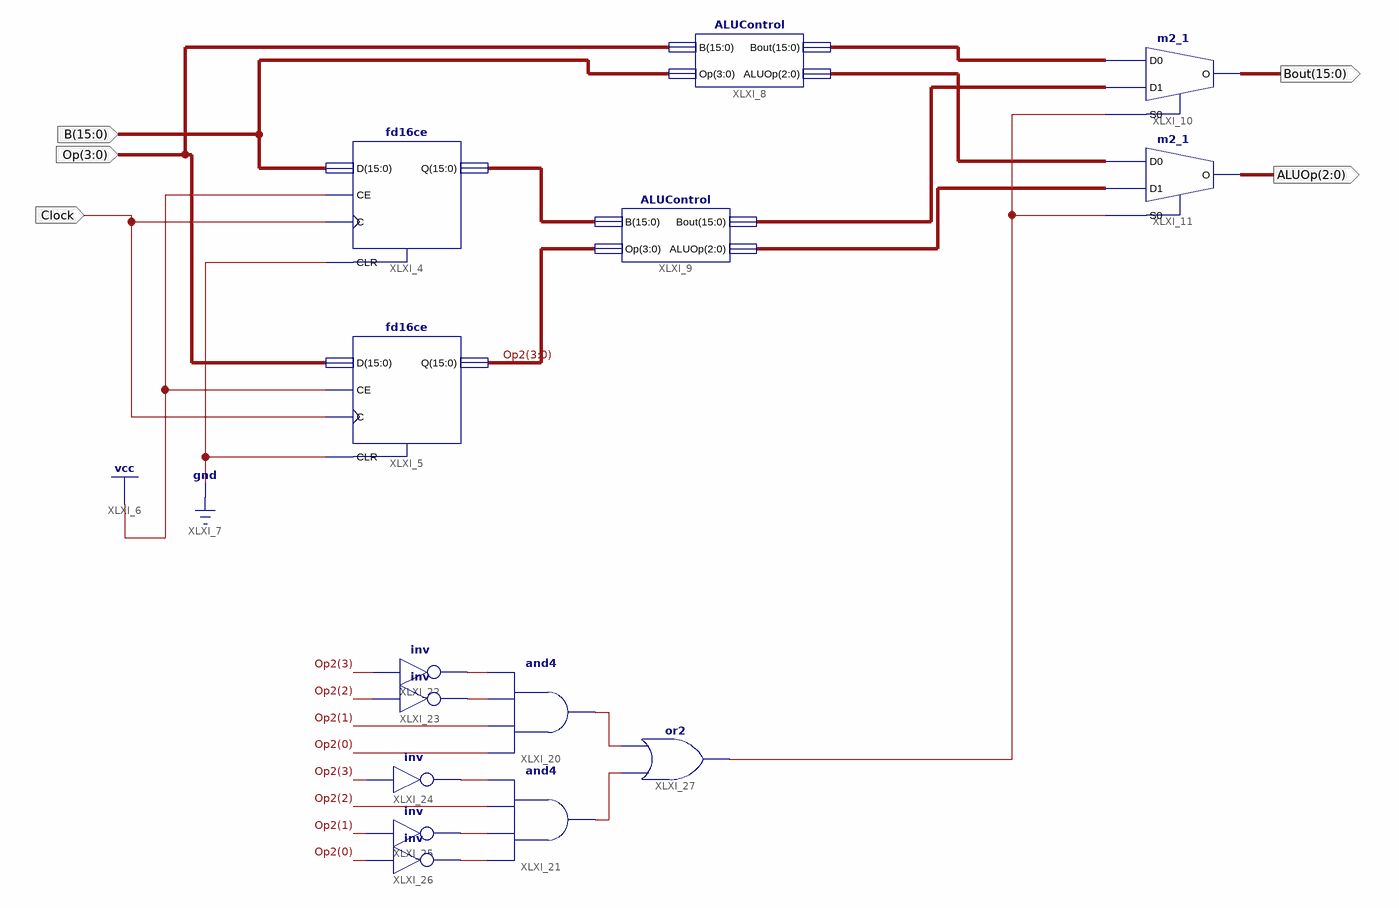
[diagram p0: schematic sheet 1]
// Xilinx ISE schematic MulticycleALU.sch (spartan3e) as structural Verilog: 14 symbols, 5 ports
module MulticycleALU (
  input  [15:0] B,
  input  [3:0] Op,
  input  Clock,
  output [15:0] Bout,
  output [2:0] ALUOp
);

  wire XLXN_39, XLXN_40, XLXN_41, XLXN_42, XLXN_43, XLXN_44, XLXN_54, XLXN_55;
  wire [2:0] XLXN_15, XLXN_20;
  wire [3:0] Op2;
  wire [15:0] XLXN_14, XLXN_16, XLXN_19;

  fd16ce XLXI_4 (.C(Clock), .CE(1'b1), .CLR(1'b0), .D(B), .Q(XLXN_16));
  fd16ce XLXI_5 (.C(Clock), .CE(1'b1), .CLR(1'b0), .D(Op), .Q(Op2));
  ALUControl XLXI_8 (.B(Op), .Op(B), .Bout(XLXN_14), .ALUOp(XLXN_15));
  ALUControl XLXI_9 (.B(XLXN_16), .Op(Op2), .Bout(XLXN_19), .ALUOp(XLXN_20));
  m2_1 XLXI_10 (.D0(XLXN_14), .D1(XLXN_19), .S0(XLXN_39), .O(Bout));
  m2_1 XLXI_11 (.D0(XLXN_15), .D1(XLXN_20), .S0(XLXN_39), .O(ALUOp));
  and XLXI_20 (XLXN_54, Op2[0], Op2[1], XLXN_41, XLXN_40);
  and XLXI_21 (XLXN_55, XLXN_44, XLXN_43, Op2[2], XLXN_42);
  not XLXI_22 (XLXN_40, Op2[3]);
  not XLXI_23 (XLXN_41, Op2[2]);
  not XLXI_24 (XLXN_42, Op2[3]);
  not XLXI_25 (XLXN_43, Op2[1]);
  not XLXI_26 (XLXN_44, Op2[0]);
  or XLXI_27 (XLXN_39, XLXN_55, XLXN_54);
endmodule
